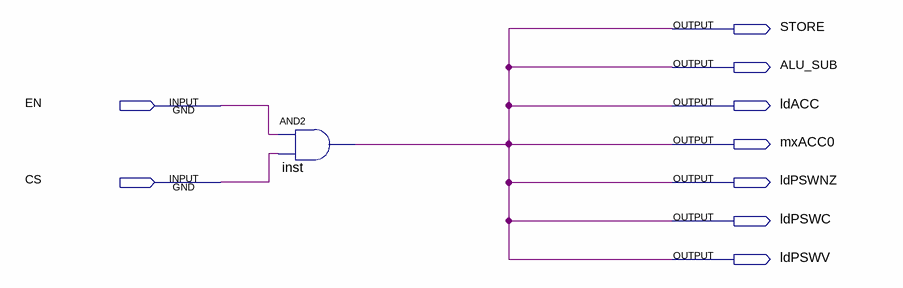
[diagram p0: schematic sheet]
// Quartus schematic SUB.bdf as structural Verilog: 1 symbols, 9 pins
module SUB (
  input  EN,
  input  CS,
  output STORE,
  output ALU_SUB,
  output ldACC,
  output mxACC0,
  output ldPSWNZ,
  output ldPSWC,
  output ldPSWV
);

  and inst (ALU_SUB, EN, CS);

  assign ldACC = ALU_SUB;
  assign ldPSWC = ALU_SUB;
  assign ldPSWNZ = ALU_SUB;
  assign ldPSWV = ALU_SUB;
  assign mxACC0 = ALU_SUB;
  assign STORE = ALU_SUB;
endmodule
